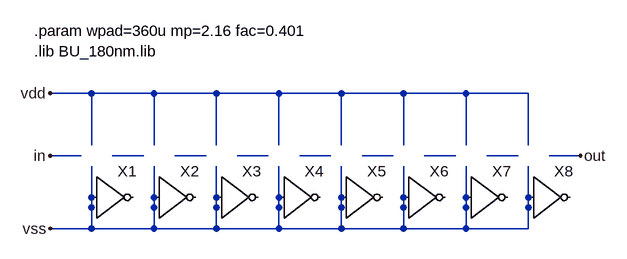
[diagram p0: schematic pad_buffer.asc]
pad_buffer.asc, the LTspice schematic file:
Version 4
SHEET 1 1168 680
WIRE 48 224 -16 224
WIRE 144 224 48 224
WIRE 240 224 144 224
WIRE 336 224 240 224
WIRE 432 224 336 224
WIRE 528 224 432 224
WIRE 624 224 528 224
WIRE 720 224 624 224
WIRE 48 304 48 224
WIRE 144 304 144 224
WIRE 240 304 240 224
WIRE 336 304 336 224
WIRE 432 304 432 224
WIRE 528 304 528 224
WIRE 624 304 624 224
WIRE 720 304 720 224
WIRE 32 320 -16 320
WIRE 128 320 80 320
WIRE 224 320 176 320
WIRE 320 320 272 320
WIRE 416 320 368 320
WIRE 512 320 464 320
WIRE 608 320 560 320
WIRE 704 320 656 320
WIRE 800 320 752 320
WIRE 48 432 48 336
WIRE 48 432 -16 432
WIRE 144 432 144 336
WIRE 144 432 48 432
WIRE 240 432 240 336
WIRE 240 432 144 432
WIRE 336 432 336 336
WIRE 336 432 240 432
WIRE 432 432 432 336
WIRE 432 432 336 432
WIRE 528 432 528 336
WIRE 528 432 432 432
WIRE 624 432 624 336
WIRE 624 432 528 432
WIRE 720 432 720 336
WIRE 720 432 624 432
FLAG -16 224 vdd
FLAG -16 320 in
FLAG 800 320 out
FLAG -16 432 vss
SYMBOL inv 48 320 R0
SYMATTR InstName X1
SYMATTR SpiceLine wn={wpad* fac * fac * fac * fac * fac * fac * fac } wp={wpad * mp * fac * fac * fac* fac * fac* fac * fac }
SYMBOL inv 144 320 R0
SYMATTR InstName X2
SYMATTR SpiceLine wn={wpad* fac * fac * fac * fac * fac * fac } wp={wpad * mp * fac * fac* fac * fac* fac * fac }
SYMBOL inv 240 320 R0
SYMATTR InstName X3
SYMATTR SpiceLine wn={wpad* fac * fac * fac * fac * fac } wp={wpad * mp * fac * fac* fac * fac* fac }
SYMBOL inv 336 320 R0
SYMATTR InstName X4
SYMATTR SpiceLine wn={wpad* fac * fac * fac * fac } wp={wpad * mp * fac* fac * fac* fac }
SYMBOL inv 432 320 R0
SYMATTR InstName X5
SYMATTR SpiceLine wn={wpad* fac * fac * fac } wp={wpad * mp * fac * fac* fac }
SYMBOL inv 528 320 R0
SYMATTR InstName X6
SYMATTR SpiceLine wn={wpad* fac * fac } wp={wpad * mp * fac* fac }
SYMBOL inv 624 320 R0
SYMATTR InstName X7
SYMATTR SpiceLine wn={wpad * fac } wp={wpad * mp * fac }
SYMBOL inv 720 320 R0
SYMATTR InstName X8
SYMATTR SpiceLine wn={wpad } wp={wpad * mp }
TEXT -40 128 Left 2 !.param wpad=360u mp=2.16 fac=0.401\n.lib BU_180nm.lib

The netlist it stands for:
* pad_buffer.asc
A§X1 vss vss vss vss vss vss vss vss BUF wn={wpad* fac * fac * fac * fac * fac * fac * fac } wp={wpad * mp * fac * fac * fac* fac * fac* fac * fac }
A§X2 vss vss vss vss vss vss vss vss BUF wn={wpad* fac * fac * fac * fac * fac * fac } wp={wpad * mp * fac * fac* fac * fac* fac * fac }
A§X3 vss vss vss vss vss vss vss vss BUF wn={wpad* fac * fac * fac * fac * fac } wp={wpad * mp * fac * fac* fac * fac* fac }
A§X4 vss vss vss vss vss vss vss vss BUF wn={wpad* fac * fac * fac * fac } wp={wpad * mp * fac* fac * fac* fac }
A§X5 vss vss vss vss vss vss vss vss BUF wn={wpad* fac * fac * fac } wp={wpad * mp * fac * fac* fac }
A§X6 vss vss vss vss vss vss vss vss BUF wn={wpad* fac * fac } wp={wpad * mp * fac* fac }
A§X7 vss vss vss vss vss vss vss vss BUF wn={wpad * fac } wp={wpad * mp * fac }
A§X8 vss vss vss vss vss vss vss vss BUF wn={wpad } wp={wpad * mp }
.param wpad=360u mp=2.16 fac=0.401
.lib BU_180nm.lib
.backanno
.end